# EAGLE design master_board (EAGLE 7.5.0)
COMPANY: ADAFRUIT INDUSTRIES; DRAWN: KTOWN; REV: B
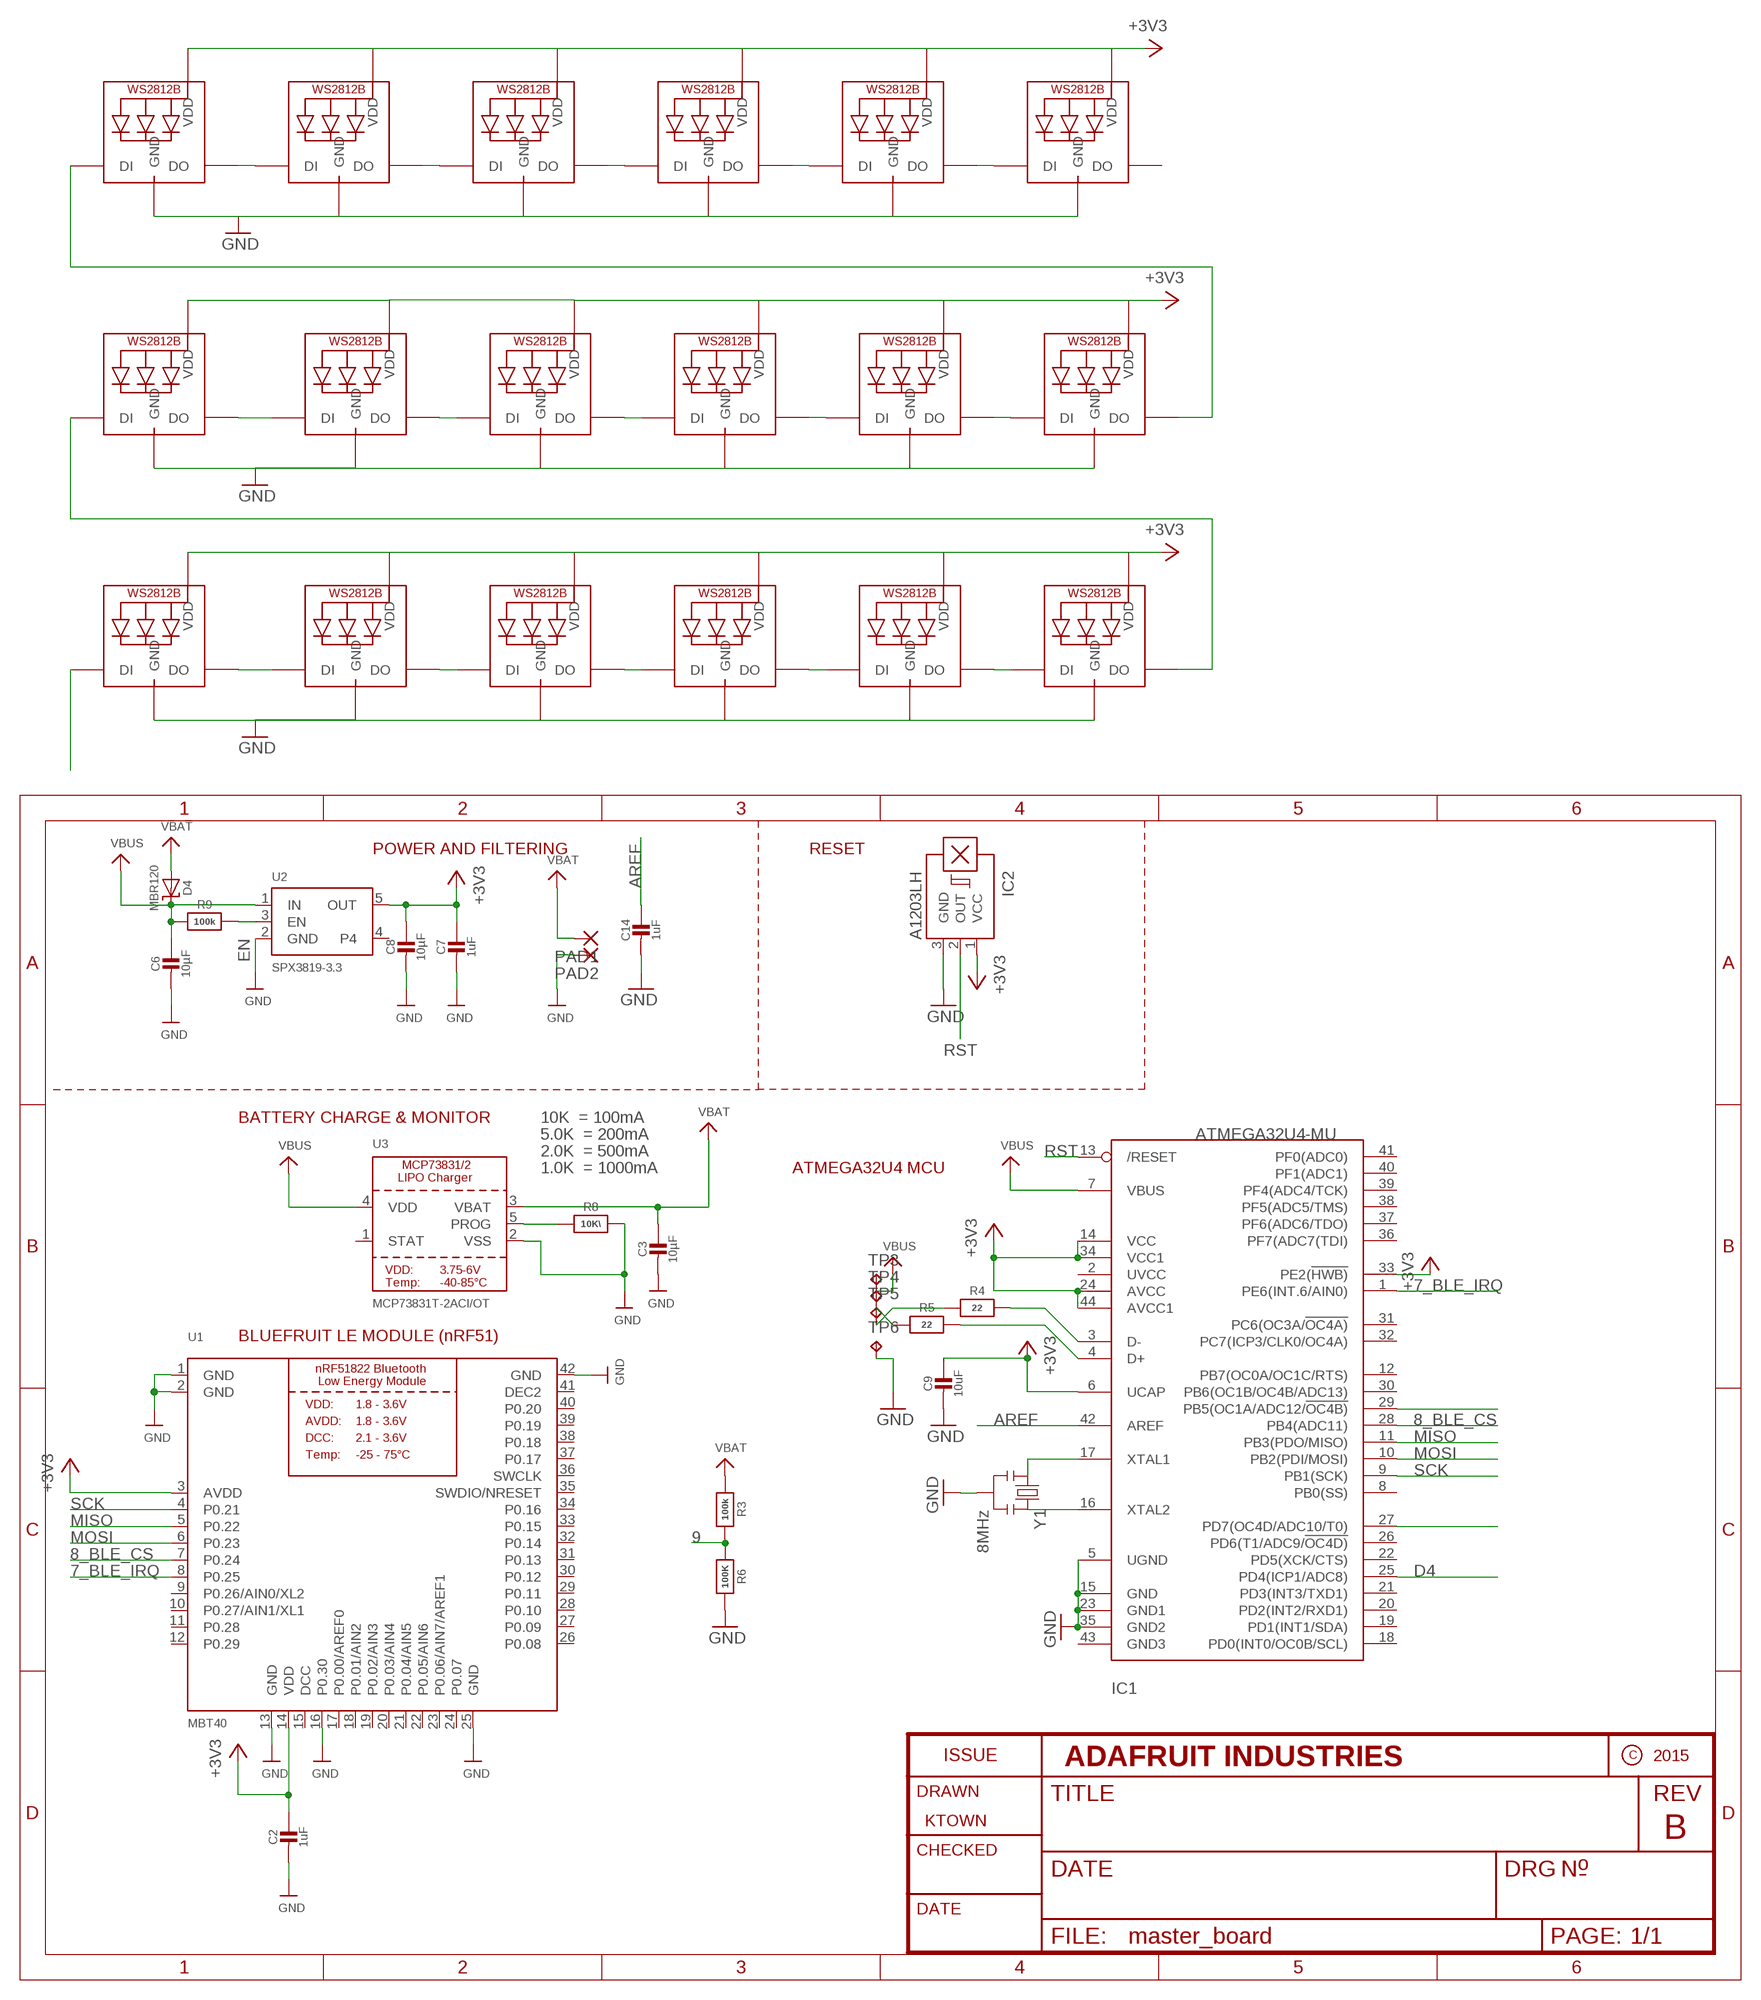
[diagram p0: schematic, sheet 1]

## Parts
C2  1uF  CAP_CERAMIC0805-NOOUTLINE  [0805-NO]
C3  10µF  CAP_CERAMIC0805-NOOUTLINE  [0805-NO]
C6  10µF  CAP_CERAMIC0805-NOOUTLINE  [0805-NO]
C7  1uF  CAP_CERAMIC0603_NO  [0603-NO]
C8  10µF  CAP_CERAMIC0805-NOOUTLINE  [0805-NO]
C9  10uF  CAP_CERAMIC0805-NOOUTLINE  [0805-NO]
C14  1uF  CAP_CERAMIC0603_NO  [0603-NO]
D4  MBR120  DIODE-SCHOTTKYSOD-123  [SOD-123]
IC1  ATMEGA32U4-MU  [TQFN44_7MM]
IC2  A1203LH  [SOT23-W]
LED1  WS2812B3535  [LED3535]
LED2  WS2812B3535  [LED3535]
LED3  WS2812B3535  [LED3535]
LED4  WS2812B3535  [LED3535]
LED5  WS2812B3535  [LED3535]
LED6  WS2812B3535  [LED3535]
LED7  WS2812B3535  [LED3535]
LED8  WS2812B3535  [LED3535]
LED9  WS2812B3535  [LED3535]
LED10  WS2812B3535  [LED3535]
LED11  WS2812B3535  [LED3535]
LED12  WS2812B3535  [LED3535]
LED13  WS2812B3535  [LED3535]
LED14  WS2812B3535  [LED3535]
LED15  WS2812B3535  [LED3535]
LED16  WS2812B3535  [LED3535]
LED17  WS2812B3535  [LED3535]
LED18  WS2812B3535  [LED3535]
PAD1  2,54/1,1  [2,54/1,1]
PAD2  2,54/1,1  [2,54/1,1]
R3  100k  RESISTOR_0603_NOOUT  [0603-NO]
R4  22  RESISTOR_0603_NOOUT  [0603-NO]
R5  22  RESISTOR_0603_NOOUT  [0603-NO]
R6  100K  RESISTOR_0603MP  [_0603MP]
R8  10K\  RESISTOR_0603_NOOUT  [0603-NO]
R9  100k  RESISTOR_0603_NOOUT  [0603-NO]
TP3  TPTP06SQ  [TP06SQ]
TP4  TPTP06SQ  [TP06SQ]
TP5  TPTP06SQ  [TP06SQ]
TP6  TPTP06SQ  [TP06SQ]
U1  MBT40  NRF51822_MODULE_MDBT40  [BLE_MODULE_RAYTAC_MDBT40]
U2  SPX3819-3.3  VREG_SOT23-5  [SOT23-5]
U3  MCP73831T-2ACI/OT  MCP73831/2  [SOT23-5]
Y1  8MHz  RESONATORSMD  [RESONATOR-SMD]

## Nets
6: IC1.27(PD7(OC4D/ADC10/T0)) LED1.1(DI)
7_BLE_IRQ: IC1.1(PE6(INT.6/AIN0)) U1.8(P0.25)
8_BLE_CS: IC1.28(PB4(ADC11)) U1.7(P0.24)
9: IC1.29(PB5(OC1A/ADC12/!OC4B)) R3.2 R6.1
+3V3: C2.1 C7.1 C8.1 C9.1 IC1.6(UCAP) IC1.14(VCC) IC1.24(AVCC) IC1.33(PE2(!HWB)) IC1.34(VCC1) IC1.44(AVCC1) IC2.1(VCC) LED1.2(VDD) LED2.2(VDD) LED3.2(VDD) LED4.2(VDD) LED5.2(VDD) LED6.2(VDD) LED7.2(VDD) LED8.2(VDD) LED9.2(VDD) LED10.2(VDD) LED11.2(VDD) LED12.2(VDD) LED13.2(VDD) LED14.2(VDD) LED15.2(VDD) LED16.2(VDD) LED17.2(VDD) LED18.2(VDD) U1.3(AVDD) U1.14(VDD) U2.5(OUT)
AREF: C14.1 IC1.42(AREF)
D4: IC1.25(PD4(ICP1/ADC8))
D+: IC1.4(D+) R5.2
D-: IC1.3(D-) R4.2
DO: LED6.3(DO) LED7.1(DI)
EN: R9.2 U2.3(EN)
GND: C2.2 C3.2 C6.2 C7.2 C8.2 C9.2 C14.2 IC1.5(UGND) IC1.15(GND) IC1.23(GND1) IC1.35(GND2) IC2.3(GND) LED1.4(GND) LED2.4(GND) LED3.4(GND) LED4.4(GND) LED5.4(GND) LED6.4(GND) LED7.4(GND) LED8.4(GND) LED9.4(GND) LED10.4(GND) LED11.4(GND) LED12.4(GND) LED13.4(GND) LED14.4(GND) LED15.4(GND) LED16.4(GND) LED17.4(GND) LED18.4(GND) PAD2.1(P) R6.2 R8.2 TP6.TP U1.1(GND) U1.2(GND) U1.13(GND) U1.16(P0.30) U1.25(GND) U1.42(GND) U2.2(GND) U3.2(VSS) Y1.2
MISO: IC1.11(PB3(PDO/MISO)) U1.5(P0.22)
MOSI: IC1.10(PB2(PDI/MOSI)) U1.6(P0.23)
N$2: LED17.3(DO) LED18.1(DI)
N$3: LED11.3(DO) LED12.1(DI)
N$4: R8.1 U3.5(PROG)
N$5: LED16.3(DO) LED17.1(DI)
N$6: LED15.3(DO) LED16.1(DI)
N$7: LED1.3(DO) LED2.1(DI)
N$8: LED2.3(DO) LED3.1(DI)
N$9: LED3.3(DO) LED4.1(DI)
N$10: LED4.3(DO) LED5.1(DI)
N$11: IC1.16(XTAL2) Y1.3
N$12: IC1.17(XTAL1) Y1.1
N$13: LED5.3(DO) LED6.1(DI)
N$14: LED7.3(DO) LED8.1(DI)
N$15: R5.1 TP4.TP
N$16: R4.1 TP5.TP
N$17: LED8.3(DO) LED9.1(DI)
N$18: LED9.3(DO) LED10.1(DI)
N$19: LED10.3(DO) LED11.1(DI)
N$27: LED14.3(DO) LED15.1(DI)
N$29: LED13.3(DO) LED14.1(DI)
N$42: LED12.3(DO) LED13.1(DI)
RST: IC1.13(/RESET) IC2.2(OUT)
SCK: IC1.9(PB1(SCK)) U1.4(P0.21)
VBAT: C3.1 D4.A PAD1.1(P) R3.1 U3.3(VBAT)
VBUS: C6.1 D4.C IC1.7(VBUS) R9.1 TP3.TP U2.1(IN) U3.4(VDD)
Unconnected: IC1.2(UVCC) IC1.8(PB0(SS)) IC1.12(PB7(OC0A/OC1C/RTS)) IC1.18(PD0(INT0/OC0B/SCL)) IC1.19(PD1(INT1/SDA)) IC1.20(PD2(INT2/RXD1)) IC1.21(PD3(INT3/TXD1)) IC1.22(PD5(XCK/CTS)) IC1.26(PD6(T1/ADC9/!OC4D)) IC1.30(PB6(OC1B/OC4B/ADC13)) IC1.31(PC6(OC3A/!OC4A)) IC1.32(PC7(ICP3/CLK0/OC4A)) IC1.36(PF7(ADC7(TDI)) IC1.37(PF6(ADC6/TDO)) IC1.38(PF5(ADC5/TMS)) IC1.39(PF4(ADC4/TCK)) IC1.40(PF1(ADC1)) IC1.41(PF0(ADC0)) IC1.43(GND3) LED18.3(DO) U1.9(P0.26/AIN0/XL2) U1.10(P0.27/AIN1/XL1) U1.11(P0.28) U1.12(P0.29) U1.17(P0.00/AREF0) U1.18(P0.01/AIN2) U1.19(P0.02/AIN3) U1.20(P0.03/AIN4) U1.21(P0.04/AIN5) U1.22(P0.05/AIN6) U1.23(P0.06/AIN7/AREF1) U1.24(P0.07) U1.26(P0.08) U1.27(P0.09) U1.28(P0.10) U1.29(P0.11) U1.30(P0.12) U1.31(P0.13) U1.32(P0.14) U1.33(P0.15) U1.34(P0.16) U1.35(SWDIO/NRESET) U1.36(SWCLK) U1.37(P0.17) U1.38(P0.18) U1.39(P0.19) U1.40(P0.20) U2.4 U3.1(STAT)

## Notes on the sheet
- POWER AND FILTERING | RESET
- BATTERY CHARGE & MONITOR | 10K  = 100mA
- 5.0K  = 200mA
- 2.0K  = 500mA
- 1.0K  = 1000mA | ATMEGA32U4 MCU
- BLUEFRUIT LE MODULE (nRF51)

## Power pins joined to a net without a drawn wire
DCC: U1.15(DCC)
DEC2: U1.41(DEC2)

## Library data of the parts
C2 C3 C6-C9 C14 = microbuilder:CAP_CERAMIC: Ceramic Capacitors For new designs, use the packages preceded by an '_' character since they are more reliable: The following footprints should be used on most boards: _0402 - Standard footprint for regular board layouts _0603 - Standard footprint for regular board layouts _0805 - Standard footprint for regular board layouts _1206 - Standard footprint for regular board layouts For extremely tight-pitch boards where space is at a premium, the following 'micro-pitch' footprints can be used (smaller pads, no silkscreen outline, etc.): _0402MP - Micro-pitch footprint for very dense/compact boards _0603MP - Micro-pitch footprint for very dense/compact boards _0805MP - Micro-pitch footprint for very dense/compact boards _1206MP - Micro-pitch footprint for very dense/compact boards
D4 = microbuilder:DIODE-SCHOTTKY
IC1 = microbuilder:ATMEGA32U4: http://www.ladyada.net/library/eagle
IC2 = allegro:A12*?: Hall-effect bipolar switch Source: http://www.allegromicro.com/en/Products/Part_Numbers/1202/1202.pdf; MF: ALLEGRO MICROSYSTEMS, INC.; MPN: A1203LLHLT-T; OC_FARNELL: 1791384; OC_NEWARK: 31K6608
LED1-LED18 = adafruit:WS2812B
PAD1 PAD2 = wirepad:2,54/1,1: THROUGH-HOLE PAD
R3-R6 R8 R9 = microbuilder:RESISTOR: Resistors For new designs, use the packages preceded by an '_' character since they are more reliable: The following footprints should be used on most boards: _0402 - Standard footprint for regular board layouts _0603 - Standard footprint for regular board layouts _0805 - Standard footprint for regular board layouts _1206 - Standard footprint for regular board layouts For extremely tight-pitch boards where space is at a premium, the following 'micro-pitch' footprints can be used (smaller pads, no silkscreen outline, etc.): _0402MP - Micro-pitch footprint for very dense/compact boards _0603MP - Micro-pitch footprint for very dense/compact boards _0805MP - Micro-pitch footprint for very dense/compact boards _1206MP - Micro-pitch footprint for very dense/compact boards
TP3-TP6 = testpad:TP: Test pad
U1 = microbuilder:NRF51822_MODULE_MDBT40: nRF51822 Bluetooth Low Energy Module
U2 = microbuilder:VREG_SOT23-5: SOT23-5 Fixed Voltage Regulators Part Current Out V Out V In V Dropout θJA (°C/W) TJ (°C) Digikey Part No. ADP121 150mA 3.3V 3.4-5.5V 0.09V @ 150mA -- -- ADP121-AUJZ33R7CT-ND ADP121 150mA 3.0V 3.1-5.5V 0.09V @ 150mA -- -- ADP121-AUJZ30R7CT-ND ADP122 300mA 3.3V 3.4-5.5V 0.085V @ 300mA -- -- ADP122AUJZ-3.3-R7CT-ND ADP1712 300mA 3.3V 3.5-5.5V 0.17V @ 300mA -- -- ADP1712AUJZ-3.3-R7TR-ND AP7311 (Low Cost) 150mA 3.3V 3.5-6V 0.15V @ 150mA -- -- AP7311-33WG-7DICT-ND LD39015M18R 150mA 1.8V 1.9V-5.5V 0.08V @ 100mA -- -- 497-6977-1-ND LP2985A-33DBVR 150mA 3.3V 3.3-16V 0.28V @ 150mA 206 150 296-18479-1-ND MCP1824T-3302E/OT 300mA 3.3V 3.5V-6V 0.2V @ 300mA -- -- MCP1824T-3302E/OTCT-ND MIC5205-2.5YM5 TR 150mA 2.5V 2.7-16V 0.165V @ 150mA -- -- 576-1257-2-ND MIC5205-3.0YM5 TR 150mA 3.0V 3.2V-16V 0.165V @ 150mA -- -- 576-1258-2-ND MIC5205-3.3YM5 TR 150mA 3.3V 3.5V-16V 0.165V @ 150mA -- -- 576-1259-2-ND TPS780330220 150mA 3.3V+2.2V 3.6-5.5V 250mV Max -- -- 296-23332-1-ND TDA3663/N1,135 100mA 3.3V 3.5-45V 0.18V @ 50mA -- -- 568-5343-1-ND Max operating temp can be calculated using θJA, TJ (max junction temperature), and power in watts. Set the "Maximum Ambient Temperature" until it reaches TJ ("Max Junction Temperature"), which is the absolute limit for safe use of the regulator: Heat Sink Temperature Calculator <http://www.daycounter.com/Calculators/Heat-Sink-Temperature-Calculator.phtml> For example, With 12V source into a 3.3V LP2985 and a 30mA load, we are dissipating (12V-3.3V) * 0.03A = 0.261W. With a θJA of 206 °C/W, a TJ of 150°C, and 261mW we can safely use the chip without a heat sink up to 75°C (=147.1°C Junction Temperature).
U3 = microbuilder:MCP73831/2: MCP73831/2 LIPO Charger VDD: 3.75 - 6V Temp -40 - 85°C Programmable Charge Rate: 15-500mA NOTE: STAT is a tri-state logic output on the MCP73831 and an open-drain output on the MCP73832. SOT23-5 with 4.2V output and tri-state logic on STAT = MCP73831T-2ACI/OT
Y1 = SparkFun:RESONATOR: Resonator Small SMD resonator. This is the itty bitty 10/20MHz resonators with built in caps. CSTCE10M0G55 and CSTCE20M0V53. Footprint has been reviewed closely but hasn't been tested yet.

## Board
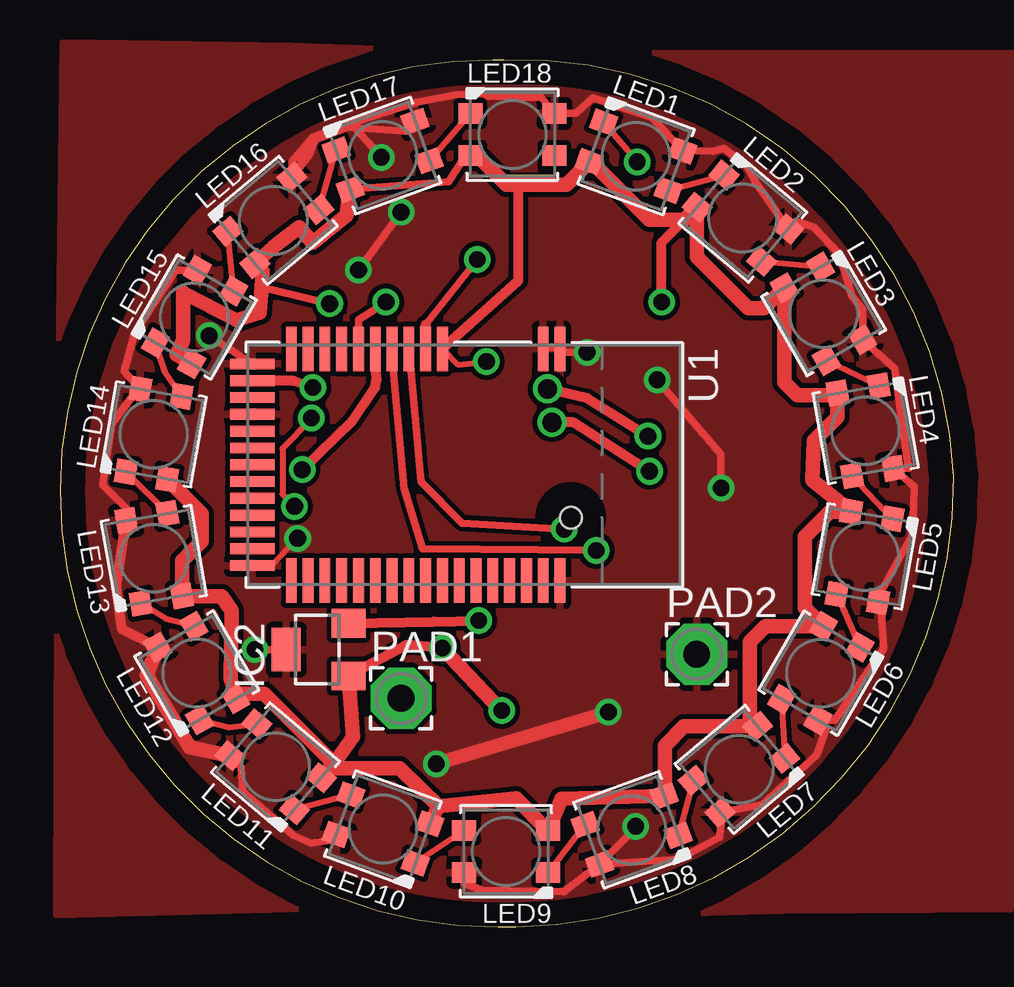
[diagram p1: board, top side]
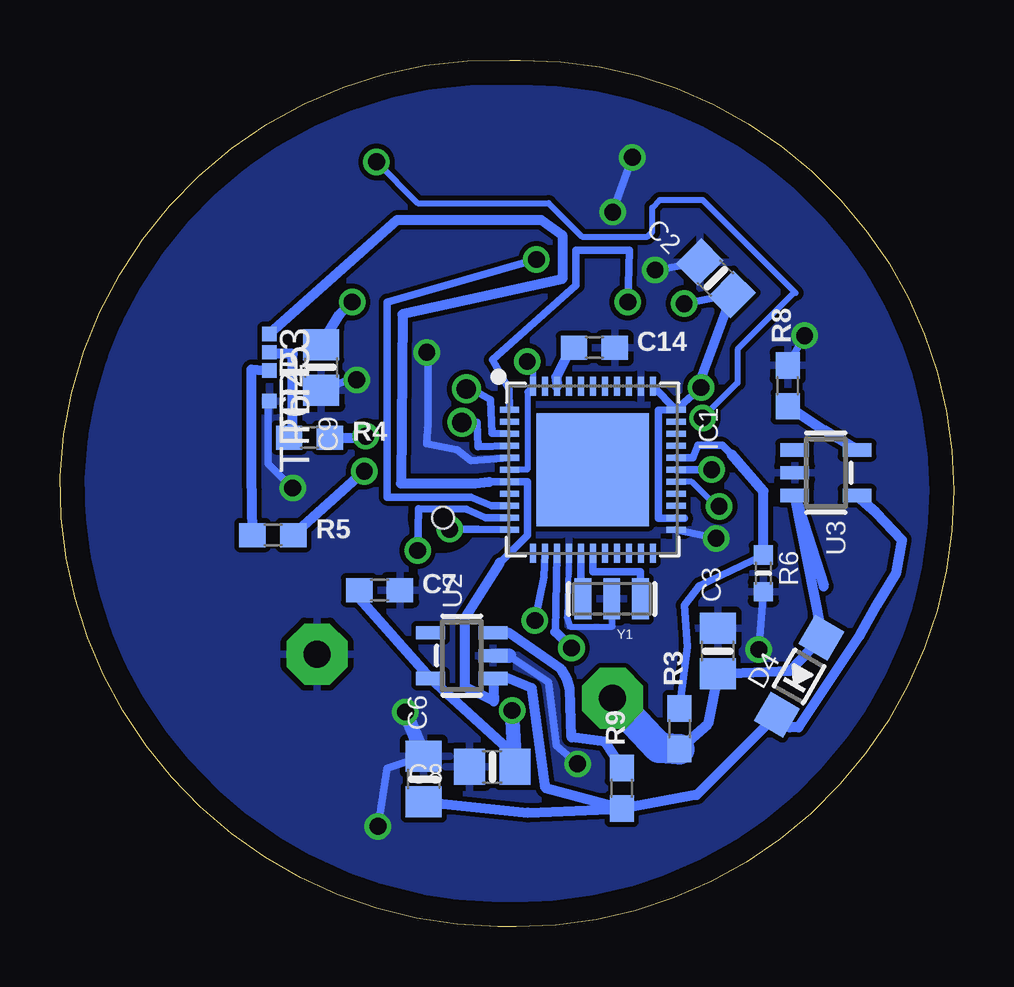
[diagram p2: board, bottom side, seen from below]

Size 37.26 x 36.12 mm. Coordinates in mm from the lower left corner, seen from the top.
Outline: 0,18.2 arc90 18.26,0 19.01,0 arc90 37.26,18.76 arc90 18.5,36.12 18.05,36.12 arc90 0,18.2
Copper layers (1*16): Top 0.035mm / dielectric 1.5mm / Bottom 0.035mm
Design rules "default": minimum track width 10mil, minimum drill 24mil, track to track 8mil, track to pad 8mil, pad to pad 8mil, via to via 8mil, smd to smd 8mil, copper to edge 40mil, drill to drill 8mil, minimum pad ring 10mil, minimum via ring 8mil, stop-mask expansion 4mil, vias tented up to drill 0mil, thermal gap 10mil

### Footprints (pad centres in the part's own frame; a part is rotated, then mirrored left to right if it is on the bottom)
0805-NO = smd 1.3 x 1.5: 1 -0.95,0; 2 0.95,0
0603-NO = smd 1.1 x 1: 1 -0.85,0; 2 0.85,0
SOD-123 = smd 1.4 x 1.4: A 1.85,0; C -1.85,0
TQFN44_7MM = smd 0.25 x 0.8: 1 -2.5,-3.475; 2 -2,-3.475; 3 -1.5,-3.475; 4 -1,-3.475; 5 -0.5,-3.475; 6 0,-3.475; 7 0.5,-3.475; 8 1,-3.475; 9 1.5,-3.475; 10 2,-3.475; 11 2.5,-3.475; 23 2.5,3.475; 24 2,3.475; 25 1.5,3.475; 26 1,3.475; 27 0.5,3.475; 28 0,3.475; 29 -0.5,3.475; 30 -1,3.475; 31 -1.5,3.475; 32 -2,3.475; 33 -2.5,3.475 | smd 0.8 x 0.25: 12 3.475,-2.5; 13 3.475,-2; 14 3.475,-1.5; 15 3.475,-1; 16 3.475,-0.5; 17 3.475,0; 18 3.475,0.5; 19 3.475,1; 20 3.475,1.5; 21 3.475,2; 22 3.475,2.5; 34 -3.475,2.5; 35 -3.475,2; 36 -3.475,1.5; 37 -3.475,1; 38 -3.475,0.5; 39 -3.475,0; 40 -3.475,-0.5; 41 -3.475,-1; 42 -3.475,-1.5; 43 -3.475,-2; 44 -3.475,-2.5 | smd 4.7 x 4.7: THERMAL 0,0
SOT23-W = smd 1.2 x 1.4: 1 -1.1,-1.3; 2 1.1,-1.3 | smd 1.8 x 1.2: 3 0,1.3
LED3535 = smd 1 x 0.85: 1 -1.75,0.875; 2 -1.75,-0.875; 3 1.75,-0.875; 4 1.75,0.875
2,54/1,1 = drill 1.118 pad 2.54 octagon: 1 0,0
_0603MP = smd 0.8 x 0.8: 1 -0.762,0; 2 0.762,0
TP06SQ = smd 0.6 x 0.6: TP 0,0
BLE_MODULE_RAYTAC_MDBT40 = smd 1.85 x 0.45: 1 -4.825,4; 2 -4.825,3.3; 3 -4.825,-0.9; 4 -4.825,-1.6; 5 -4.825,-2.3; 6 -4.825,-3; 7 -4.825,-3.7; 8 -4.825,-4.4; 9 -4.825,-5.1; 10 -4.825,-5.8; 11 -4.825,-6.5; 12 -4.825,-7.2; 26 4.825,-7.2; 27 4.825,-6.5; 28 4.825,-5.8; 29 4.825,-5.1; 30 4.825,-4.4; 31 4.825,-3.7; 32 4.825,-3; 33 4.825,-2.3; 34 4.825,-1.6; 35 4.825,-0.9; 36 4.825,-0.2; 37 4.825,0.5; 38 4.825,1.2; 39 4.825,1.9; 40 4.825,2.6; 41 4.825,3.3; 42 4.825,4 | smd 0.45 x 1.85: 13 -4.2,-8.825; 14 -3.5,-8.825; 15 -2.8,-8.825; 16 -2.1,-8.825; 17 -1.4,-8.825; 18 -0.7,-8.825; 19 0,-8.825; 20 0.7,-8.825; 21 1.4,-8.825; 22 2.1,-8.825; 23 2.8,-8.825; 24 3.5,-8.825; 25 4.2,-8.825 | hole 0.9: 2.2,4.45
SOT23-5 = smd 0.55 x 1.2: 1 -0.95,-1.3; 2 0,-1.3; 3 0.95,-1.3; 4 0.95,1.3; 5 -0.95,1.3
RESONATOR-SMD = smd 0.7 x 1.7: 1 -1.2,0; 2 0,0; 3 1.2,0

### Placement (x,y rotation side)
C2  9.92,27.03 135 bottom
C3  9.84,11.49 90 bottom
C6  22.1,6.16 90 bottom
C7  23.94,14.03 0 bottom
C8  19.24,6.67 180 bottom
C9  26.38,23.31 270 bottom
C14  14.99,24.13 0 bottom
D4  6.45,10.44 60 bottom
IC1  15.05,19.05 270 bottom
IC2  10.73,11.56 90 top
LED1  24.01,32.11 340 top
LED2  28.46,29.53 320 top
LED3  31.83,25.55 300 top
LED4  33.58,20.67 280 top
LED5  33.54,15.43 260 top
LED6  31.71,10.57 240 top
LED7  28.31,6.57 220 top
LED8  23.84,4.04 200 top
LED9  18.6,3.14 180 top
LED10  13.47,4.08 160 top
LED11  8.99,6.67 140 top
LED12  5.71,10.58 120 top
LED13  3.92,15.36 100 top
LED14  3.91,20.53 80 top
LED15  5.61,25.42 60 top
LED16  8.89,29.44 40 top
LED17  13.46,32.15 20 top
LED18  18.86,33.02 0 top
PAD1  14.22,9.53 0 top
PAD2  26.54,11.37 0 top
R3  11.43,8.26 90 bottom
R4  26.86,20.38 0 bottom
R5  28.38,16.32 0 bottom
R6  7.94,14.73 270 bottom
R8  6.92,22.54 90 bottom
R9  13.84,5.78 90 bottom
TP3  28.53,24.71 270 bottom
TP4  28.53,23.18 270 bottom
TP5  28.53,23.94 270 bottom
TP6  28.53,21.91 270 bottom
U1  16.84,19.26 270 top
U2  20.51,11.3 90 bottom
U3  5.33,18.92 270 bottom
Y1  14.26,13.67 180 bottom

### Tracks (layer width: path | path; a pad name or v marks a point on that pad's centre or on a via)
6  (via drill 0.7)
  Top 0.254: LED1.1 v24.07,31.88 | v10.48,21.21 10.48,21.15 9.27,19.94 9.27,18.03 v9.78,17.53
  Bottom 0.254: v24.07,31.88 22.35,30.16 16.89,30.16 15.49,28.77 12.76,28.77 12.57,28.96 12.57,29.97 12.26,30.29 10.48,30.29 6.6,26.42 6.67,26.42 9.02,24.07 9.02,22.67 v10.48,21.21 | v9.78,17.53 9.91,17.53 10.92,18.54 IC1.27
7_BLE_IRQ  (via drill 0.7)
  Top 0.305: U1.8 12.45,25.29 v13.59,26.04
  Bottom 0.305: v13.59,26.04 13.53,28.19 15.75,28.19 15.75,26.73 19.24,23.62 18.54,22.39 IC1.1
8_BLE_CS  (via drill 0.7)
  Top 0.406: v10.1,19.05 12.19,21.1 13.14,22.48 13.21,22.8 U1.7
  Bottom 0.305: IC1.28 v10.1,19.05
9
  Bottom 0.305: IC1.29 10.87,19.55 10.68,20.07 9.65,20.07 9.27,19.69 | R6.1 10.6,14.22 11.24,13.4 11.11,11.68 R3.2
  Bottom 0.406: R6.1 7.94,18.16 9.27,19.69
+3V3  (via drill 0.7)
  Top 0.254: LED7.2 28.77,8.55 | U1.3 16.59,23.43 v17.78,23.56
  Top 0.305: v11.24,25.97 8.4,26.64 | U1.3 19.05,26.86 19.11,30.86 16.95,32.19 16.19,31.05 LED17.2
  Top 0.406: U1.3 19.11,26.93 19.11,30.86 19.11,30.93 | v10.54,22.48 9.76,22.76 U1.14 | v25.08,26.04 25.08,28.51 LED2.2 | v15.94,11.62 14.47,11.75 IC2.1
  Top 0.61: IC2.1 12.22,7.93 11.27,6.6 | LED11.2 11.27,6.6 | 11.27,6.6 14.16,6.6 15.79,5.04 | 15.79,5.04 LED10.2 | 15.79,5.04 19.01,5.36 LED9.2 20.9,5.33 LED8.2 25.21,5.49 25.21,7.56 26.01,8.36 LED7.2 28.77,8.68 28.77,11.87 29.41,12.52 LED6.2 31.05,13.3 31.05,16.26 32.1,17.31 LED5.2 31.37,18.6 31.43,20.26 32.41,21.24 LED4.2 32.33,22.16 30.73,22.16 30.2,22.7 LED3.2 29.35,25.78 28.7,25.78 26.56,27.92 LED2.2 26.03,29.46 24.57,29.46 22.15,31.89 LED1.2 21.1,30.93 19.11,30.93 18.61,30.93 17.38,32.15 LED18.2 | LED17.2 12.06,30.68 11.94,29.65 10.54,28.51 9.97,29.15 8.91,28.34 LED16.2 8.45,27.31 8.4,26.64 8.32,25.59 7.37,25.27 5.14,26.42 5.14,24.45 4.86,23.85 LED15.2 | LED14.2 5.91,17.22 5.91,16.07 5.09,15.25 LED13.2 5.1,13.78 6.73,13.78 7.15,13.17 7.11,10.35 LED12.2 7.56,9.72 8.51,9.72 11.27,6.95 11.27,6.6 | v18.41,9.02 v15.94,11.62
  Bottom 0.254: v17.78,23.56 17.55,23.14 IC1.44 17.78,22.3 17.78,19.05 IC1.6
  Bottom 0.305: 10.54,22.46 IC1.33 | IC1.33 IC1.34 | IC1.33 11.91,21.55 12.32,21.53 12.32,17.02 11.62,17.02 | 11.62,17.02 11.23,17.02 | IC1.14 16.61,12.3 | IC1.24 11.62,17.02 | C2.1 v11.24,25.97
  Bottom 0.406: 10.54,22.46 v10.54,22.48 10.65,22.59 C2.1 | 18.35,7.21 U2.5 24.79,13.71 C7.1 | C9.1 25.6,25.52 v25.08,26.04 | 16.61,12.3 v15.94,11.62
  Bottom 0.61: 18.35,7.21 C8.1 v18.41,9.02
AREF
  Bottom 0.406: C14.1 16.17,23.73 16.57,22.92 IC1.42
D+  (via drill 0.7, 0.8)
  Top 0.406: v24.57,18.99 21.4,21.02 v20.51,21.02
  Bottom 0.305: v20.51,21.02 19.88,21.02 19.84,20 IC1.4
  Bottom 0.406: R5.2 24.64,18.92 v24.57,18.99
D-  (via drill 0.7, 0.8)
  Top 0.406: v24.51,20.45 21.97,22.04 20.83,22.29 v20.32,22.42
  Bottom 0.305: v20.32,22.42 20,22.35 19.3,21.97 19.25,20.57 IC1.3
  Bottom 0.406: R4.2 24.83,20.38 v24.51,20.45
DO
  Top 0.254: LED6.3 LED7.1
EN
  Bottom 0.406: R9.2 14.54,7.71 15.94,7.9 16,9.91 16.13,10.35 16.36,10.73 18.54,12.26 U2.3
GND  (via drill 0.7)
  Top 0.254: LED7.4 27.24,4.96 | U1.2 U1.1 20.64,24.08 | v9.91,16.19 8.83,15.05
  Top 0.305: LED7.4 29.28,5.09 31.56,7.18 31.94,8.27 LED6.4 32.3,8.62 34.35,11.62 34.23,13.43 LED5.4 34.1,13.72 35.56,16.38 35.62,18.35 LED4.4 35.36,19.1 35.37,19.11 34.8,23.27 LED3.4 33.46,25.72 33.02,26.29 32.51,28 31.43,29.15 30.69,29.4 LED2.4 28.96,31.12 28.64,31.69 27.69,32.45 27.24,32.32 LED1.4 24.7,33.72 22.23,34.54 21.51,33.9 LED18.4 20.07,34.54 17.84,34.61 17.65,34.73 16.51,34.67 14.86,34.35 11.68,33.34 10.6,32.83 LED16.4 | 27.24,4.96 27.62,4.58 27.5,3.75 25.8,2.81 LED8.4 | LED8.4 23.88,4.01 v24,4.19 | LED9.4 16.85,1.82 17.59,1.52 21.01,1.46 LED8.4 | LED10.4 11.52,3.65 10.48,3.49 9.72,3.81 7.62,5.65 7.56,6.65 LED11.4 | LED13.4 2.76,17.44 1.78,18.42 2.16,20.96 3.23,22.41 LED14.4 2.67,23.16 3.11,24.77 4.83,27.37 LED15.4 | LED16.4 9.67,31.9 10.54,32.89 11.75,33.34 14.38,33.15 LED17.4 | v21.97,23.94 20.98,23.94 U1.1 | v27.56,18.29 27.56,19.69 v24.89,22.8 | v8.13,11.56 IC2.3 | 8.83,15.05 U1.25 | LED16.4 10.41,32.19 10.67,32.83 12.19,33.4 v13.4,32.07 | v14.22,29.78 v12.45,27.37 | U1.13 v6.22,24.64
  Top 0.406: LED12.4 2.6,12.38 2.35,14.16 LED13.4
  Top 0.61: v15.68,6.8 v22.86,8.95 | LED11.4 5.4,7.49 3.62,10.48 LED12.4
  Bottom 0.254: IC1.15 16.13,12.89 16,12.51 14.22,12.51 Y1.2
  Bottom 0.305: v24,4.19 23.62,6.6 C6.2 | IC1.5 20.12,19.42 20.7,19.88 21.97,20.13 21.91,20.96 21.91,23.88 v21.97,23.94 | TP6.TP 28.57,21.91 28.57,19.3 v27.56,18.29 | v24.89,22.8 25.37,22.73 C9.2 | 18.54,11.3 16.89,10.19 16.57,7.56 v15.68,6.8 | R6.2 v8.13,11.56 | IC1.23 v9.91,16.19 | v13.4,32.07 v14.22,29.78 | v12.45,27.37 C2.2 | v6.22,24.64 R8.2
  Bottom 0.61: U2.2 18.54,11.3 | v22.86,8.95 C6.2
  pour Bottom: -0.06,36.96 28.07,36.51 40.32,36.51 39.75,9.84 39.56,0.76 9.84,0.51 -0.13,0.51 -0.13,25.59
  pour Top: 18.54,36.39 39.88,36.39 40.07,24.83 39.94,18.16 39.75,10.48 39.62,0.76 30.1,0.7 23.3,0.51 12,0.83 -0.13,0.51 -0.06,20.19 0.13,36.83 9.59,36.7
MISO  (via drill 0.7)
  Top 0.305: v21.02,16.57 16.76,16.83 15.05,18.54 U1.5
  Bottom 0.305: IC1.11 19.83,16.57 v21.02,16.57
MOSI  (via drill 0.7)
  Top 0.305: 13.84,23.76 14.35,18.29 15.11,15.75 v22.35,15.69
  Top 0.406: U1.6 13.84,23.76
  Bottom 0.305: v22.35,15.69 22.32,17.43 20.32,17.4 19.53,17.05 IC1.10
N$2
  Top 0.254: LED17.3 LED18.1
N$3
  Top 0.254: LED12.1 7.05,8.32 LED11.3
N$4
  Bottom 0.406: U3.5 5.43,20.71 R8.1
N$5
  Top 0.254: LED16.3 LED17.1
N$6
  Top 0.254: LED15.3 LED16.1
N$7
  Top 0.254: LED1.3 LED2.1
N$8
  Top 0.254: LED2.3 LED3.1
N$9
  Top 0.254: LED3.3 LED4.1
N$10
  Top 0.254: LED4.3 LED5.1
N$11
  Bottom 0.305: 15.55,14.02 IC1.16
  Bottom 0.406: Y1.3 15.55,14.02
N$12
  Bottom 0.305: Y1.1 13.06,14.8 15.05,14.8 IC1.17
N$13
  Top 0.254: LED5.3 LED6.1
N$14
  Top 0.254: LED7.3 LED8.1
N$15
  Bottom 0.406: R5.1 29.27,18.92 29.27,23.23 TP4.TP
N$16
  Bottom 0.406: R4.1 27.56,20.51 27.56,23.88 28.46,23.88 TP5.TP
N$17
  Top 0.254: LED8.3 LED9.1
N$18
  Top 0.254: LED9.3 LED10.1
N$19
  Top 0.254: LED10.3 LED11.1
N$27
  Top 0.254: LED14.3 4.38,23.11 LED15.1
N$29
  Top 0.254: LED13.3 LED14.1
N$42
  Top 0.254: LED12.3 4.44,12.83 LED13.1
RST  (via drill 0.7)
  Top 0.406: IC2.2 15.58,12.72 v17.46,12.76
  Bottom 0.305: v17.46,12.76 17.08,14.59 IC1.13
SCK  (via drill 0.7)
  Top 0.305: 15.24,25.1 v17.4,27.81
  Top 0.406: U1.4 15.24,25.1
  Bottom 0.305: v17.4,27.81 23.62,26.04 23.62,17.91 20.13,17.91 19.26,17.55 IC1.9
VBAT
  Bottom 0.406: R3.1 10.26,8.45 C3.1 6.84,10.67 D4.A 5.53,12.35 U3.3 5.43,14.19
  Bottom 1.27: R3.1 12.29,7.47 PAD1.1
VBUS
  Bottom 0.305: 19.37,18.54 18.8,18.55 IC1.7 17.78,18.54 17.78,16.32 18.92,15.18
  Bottom 0.406: U3.4 3.24,17.27 2.16,16.13 2.41,14.73 3.24,13.4 3.94,12.13 6.48,8.32 6.85,8.32 D4.C 10.72,5.5 R9.1 | R9.1 17.02,5.78 17.59,9.95 18.58,10.36 U2.1 19.17,9.4 20.32,9.97 20.38,10.03 20.38,12.89 18.92,15.18 | C6.1 17.75,4.77 R9.1 | TP3.TP 23.2,29.46 17.21,29.46 16.32,28.83 16.32,26.99 22.99,25.53 23.05,18.48 19.94,18.48 19.37,18.54